# Altium schematic sheet 9_ESP32_GPIO_header.SchDoc
size A4; SheetNumber: 10; SheetTotal: 13
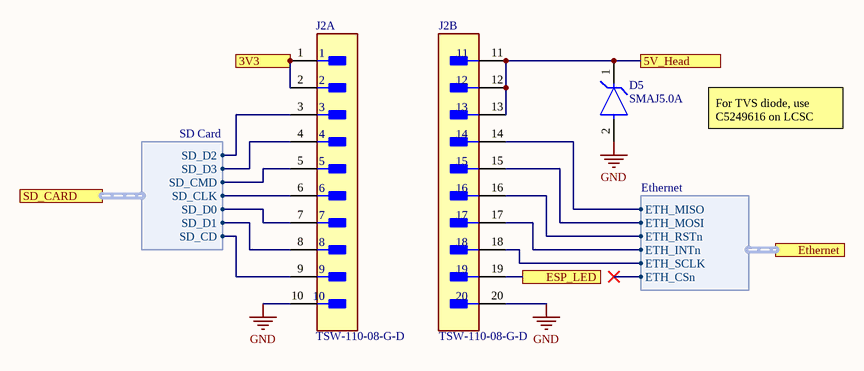
[diagram p0: 9_ESP32_GPIO_header.SchDoc]

## Parts
D5  SMAJ5.0A  [FP-SMA-MFG]
J2  TSW-110-08-G-D  [FP-TSW-110-08-G-D-MFG]  (parts A,B of 2)

## Ports
3V3, 5V_Head, ESP_LED, Ethernet (harness Ethernet), SD_CARD (harness SD Card)

## Harnesses
SD Card: SD_D2, SD_D3, SD_CMD, SD_CLK, SD_D0, SD_D1, SD_CD
Ethernet: ETH_MISO, ETH_MOSI, ETH_INTn, ETH_CSn, ETH_SCLK, ETH_RSTn

## Nets
GND: D5.2(A) J2.10 J2.20
3V3: J2.1 J2.2 ; port 3V3
5V_Head: D5.1(C) J2.11 J2.12 J2.13 ; port 5V_Head
ESP_LED: J2.19 ; port ESP_LED
NetJ2_3: J2.3 ; port SD_CARD.SD_D2
NetJ2_4: J2.4 ; port SD_CARD.SD_D3
NetJ2_5: J2.5 ; port SD_CARD.SD_CMD
NetJ2_6: J2.6 ; port SD_CARD.SD_CLK
NetJ2_7: J2.7 ; port SD_CARD.SD_D0
NetJ2_8: J2.8 ; port SD_CARD.SD_D1
NetJ2_9: J2.9 ; port SD_CARD.SD_CD
NetJ2_14: J2.14 ; port Ethernet.ETH_MISO
NetJ2_15: J2.15 ; port Ethernet.ETH_MOSI
NetJ2_16: J2.16 ; port Ethernet.ETH_RSTn
NetJ2_17: J2.17 ; port Ethernet.ETH_INTn
NetJ2_18: J2.18 ; port Ethernet.ETH_SCLK

## Notes on the sheet
- For TVS diode, use C5249616 on LCSC
- Date:
- A4
- Project:
- Time:
- Sheet
- of
- Revision:
- File:
- Drawn By:

## Library data of the parts
D5 = CMP-12828-000007-1: TVS DIODE 5V 9.2V SMA; Manufacturer: Diodes Inc.; Manufacturer Part Number: SMAJ5.0A-13-F; Peak Pulse Power: 400W; Number Of Channels: 1; Max Junction Temp: +150°C; Peak Pulse Current: 43.5A; Breakdown Voltage: 6.4V; Direction: Unidirectional; Standoff Height: 0.05mm; Device Class L3: unset; Mouser Description: TVS DIODE 5V 9.2V SMA; Device Class L1: Circuit Protection; Temperature Range High: +150°C; Category: Diode; ComponentLink2Description: Datasheet; Temperature Range Low: -55°C; Device Class L2: TVS Diodes; RoHS: TRUE; Automotive: No; Footprint Url: https://www.diodes.com/assets/Package-Files/SMA.pdf; Reverse Standoff Voltage: 5V; Clamping Voltage: 9.2V; Temperature: -55°C to +150°C; Height: 2.4mm; Octopart: https://octopart.com/smaj5.0a-13-f-diodes+inc.-350158; Lead Free: Yes; Digikey Description: TVS DIODE 5V 9.2V SMA; Package: SMA; ComponentLink2URL: https://www.diodes.com/assets/Datasheets/ds19005.pdf
J2 = CMP-02766-000083-1: CONN HEADER VERT 20POS 2.54MM; Manufacturer: Samtec; Conn Gender: Male; Number Of Contacts: 20; Conn Orientation: Straight; Lead Free: Yes; Category: Conn; Manufacturer Part Number: TSW-110-08-G-D; Temperature Range High: +125°C; Pitch: 2.54mm; Temperature: -55°C to +125°C; Automotive: No; Device Class L1: Connectors; ComponentLink2URL: http://suddendocs.samtec.com/prints/tsw-xxx-xx-xxx-x-xx-xxx-mkt.pdf; Temperature Range Low: -55°C; ComponentLink2Description: Datasheet; Height: 8.71mm; Number Of Rows: 2; Digikey Description: CONN HEADER VERT 20POS 2.54MM; Package: TSW-110-08-G-D; Device Class L3: unset; Contact Material: Gold,Nickel; Octopart: https://octopart.com/tsw-110-08-g-d-samtec-272555; Footprint Url: http://suddendocs.samtec.com/prints/tsw-xxx-xx-x-x-xx-xxx-footprint.pdf; RoHS: TRUE; Ipc Land Pattern Name: CAPAD1016W80L630D240; Device Class L2: Headers and Wire Housings